# EAGLE design AdapterBoard (EAGLE 8.5.1)
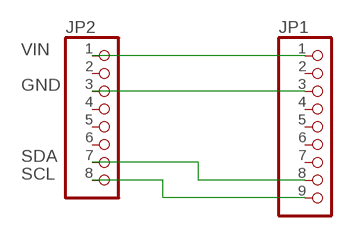
[diagram p0: schematic, sheet 1]

## Parts
JP1  PINHD-1X9  [1X09]
JP2  PINHD-1X8  [1X08]

## Nets
GND: JP1.3 JP2.3
SCL: JP1.9 JP2.8
SDA: JP1.8 JP2.7
VIN: JP1.1 JP2.1
Unconnected: JP1.2 JP1.4 JP1.5 JP1.6 JP1.7 JP2.2 JP2.4 JP2.5 JP2.6

## Library data of the parts
JP1 = pinhead:PINHD-1X9: PIN HEADER
JP2 = pinhead:PINHD-1X8: PIN HEADER

## Board
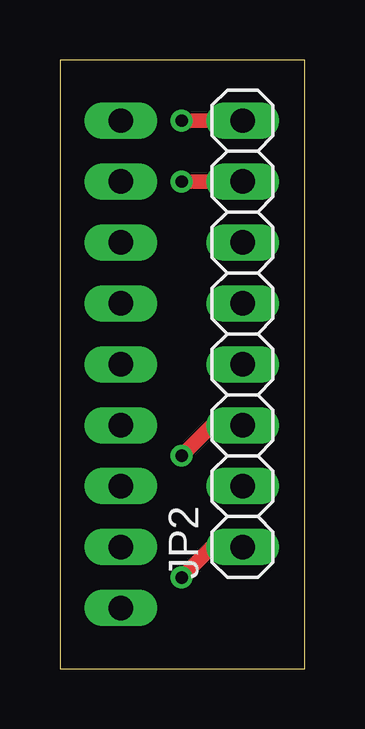
[diagram p1: board, top side]
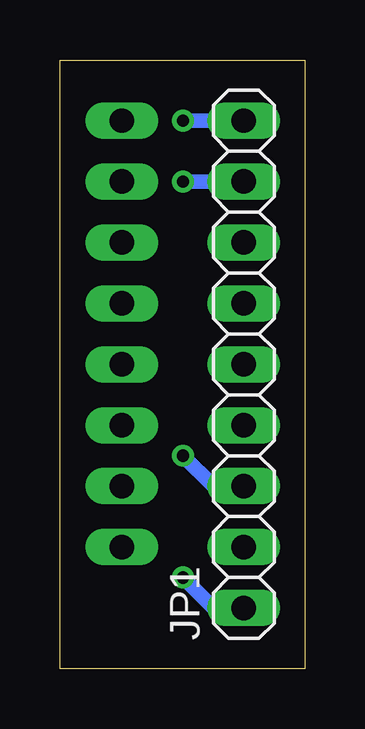
[diagram p2: board, bottom side, seen from below]

Size 10.21 x 25.39 mm. Coordinates in mm from the lower left corner, seen from the top.
Outline: 0,0 10.21,0 10.21,25.39 0,25.39 0,0
Copper layers (1*16): Top 0.035mm / dielectric 1.5mm / Bottom 0.035mm
Design rules "DRC Electronics Lab": minimum track width 16mil, minimum drill 19mil, track to track 16mil, track to pad 12mil, pad to pad 16mil, via to via 16mil, smd to smd 10mil, copper to edge 40mil, drill to drill 10mil, minimum pad ring 10mil, minimum via ring 8mil, stop-mask expansion 4mil, vias tented up to drill 0mil, thermal gap 10mil

### Footprints (pad centres in the part's own frame; a part is rotated, then mirrored left to right if it is on the bottom)
1X09 = drill 1.016 long: 1 -10.16,0; 2 -7.62,0; 3 -5.08,0; 4 -2.54,0; 5 0,0; 6 2.54,0; 7 5.08,0; 8 7.62,0; 9 10.16,0
1X08 = drill 1.016 long: 1 -8.89,0; 2 -6.35,0; 3 -3.81,0; 4 -1.27,0; 5 1.27,0; 6 3.81,0; 7 6.35,0; 8 8.89,0

### Placement (x,y rotation side)
JP1  2.54,12.7 90 bottom
JP2  7.62,13.97 90 top

### Tracks (layer width: path | path; a pad name or v marks a point on that pad's centre or on a via)
GND  (via drill 0.51)
  Top 0.61: v5.08,8.89 6.35,10.16 JP2.3
  Bottom 0.61: JP1.3 3.81,7.62 v5.08,8.89
SCL  (via drill 0.51)
  Top 0.61: v5.08,22.86 JP2.8
  Bottom 0.61: JP1.9 v5.08,22.86
SDA  (via drill 0.51)
  Top 0.61: v5.08,20.32 JP2.7
  Bottom 0.61: JP1.8 v5.08,20.32
VIN  (via drill 0.51)
  Top 0.61: v5.08,3.81 6.35,5.08 JP2.1
  Bottom 0.61: JP1.1 3.81,2.54 v5.08,3.81